# Altium schematic sheet 5V_TO_3V3_VOLTAGE_DIVIDER.SchDoc
size A4
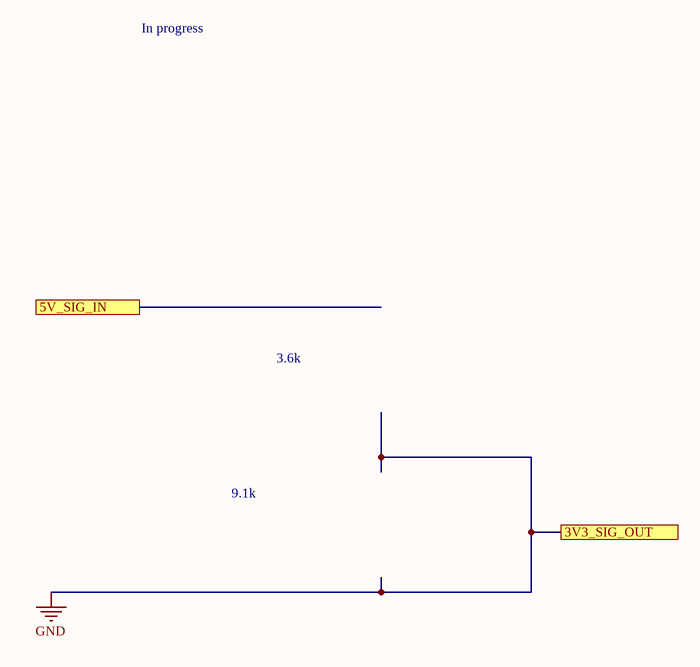
[diagram p0: 5V_TO_3V3_VOLTAGE_DIVIDER.SchDoc]

## Ports
3V3_SIG_OUT, 5V_SIG_IN

## Nets
GND: port 3V3_SIG_OUT

## Notes on the sheet
- In progress
- 3.6k
- 9.1k